# Altium schematic sheet nguyenly.schdoc
size B
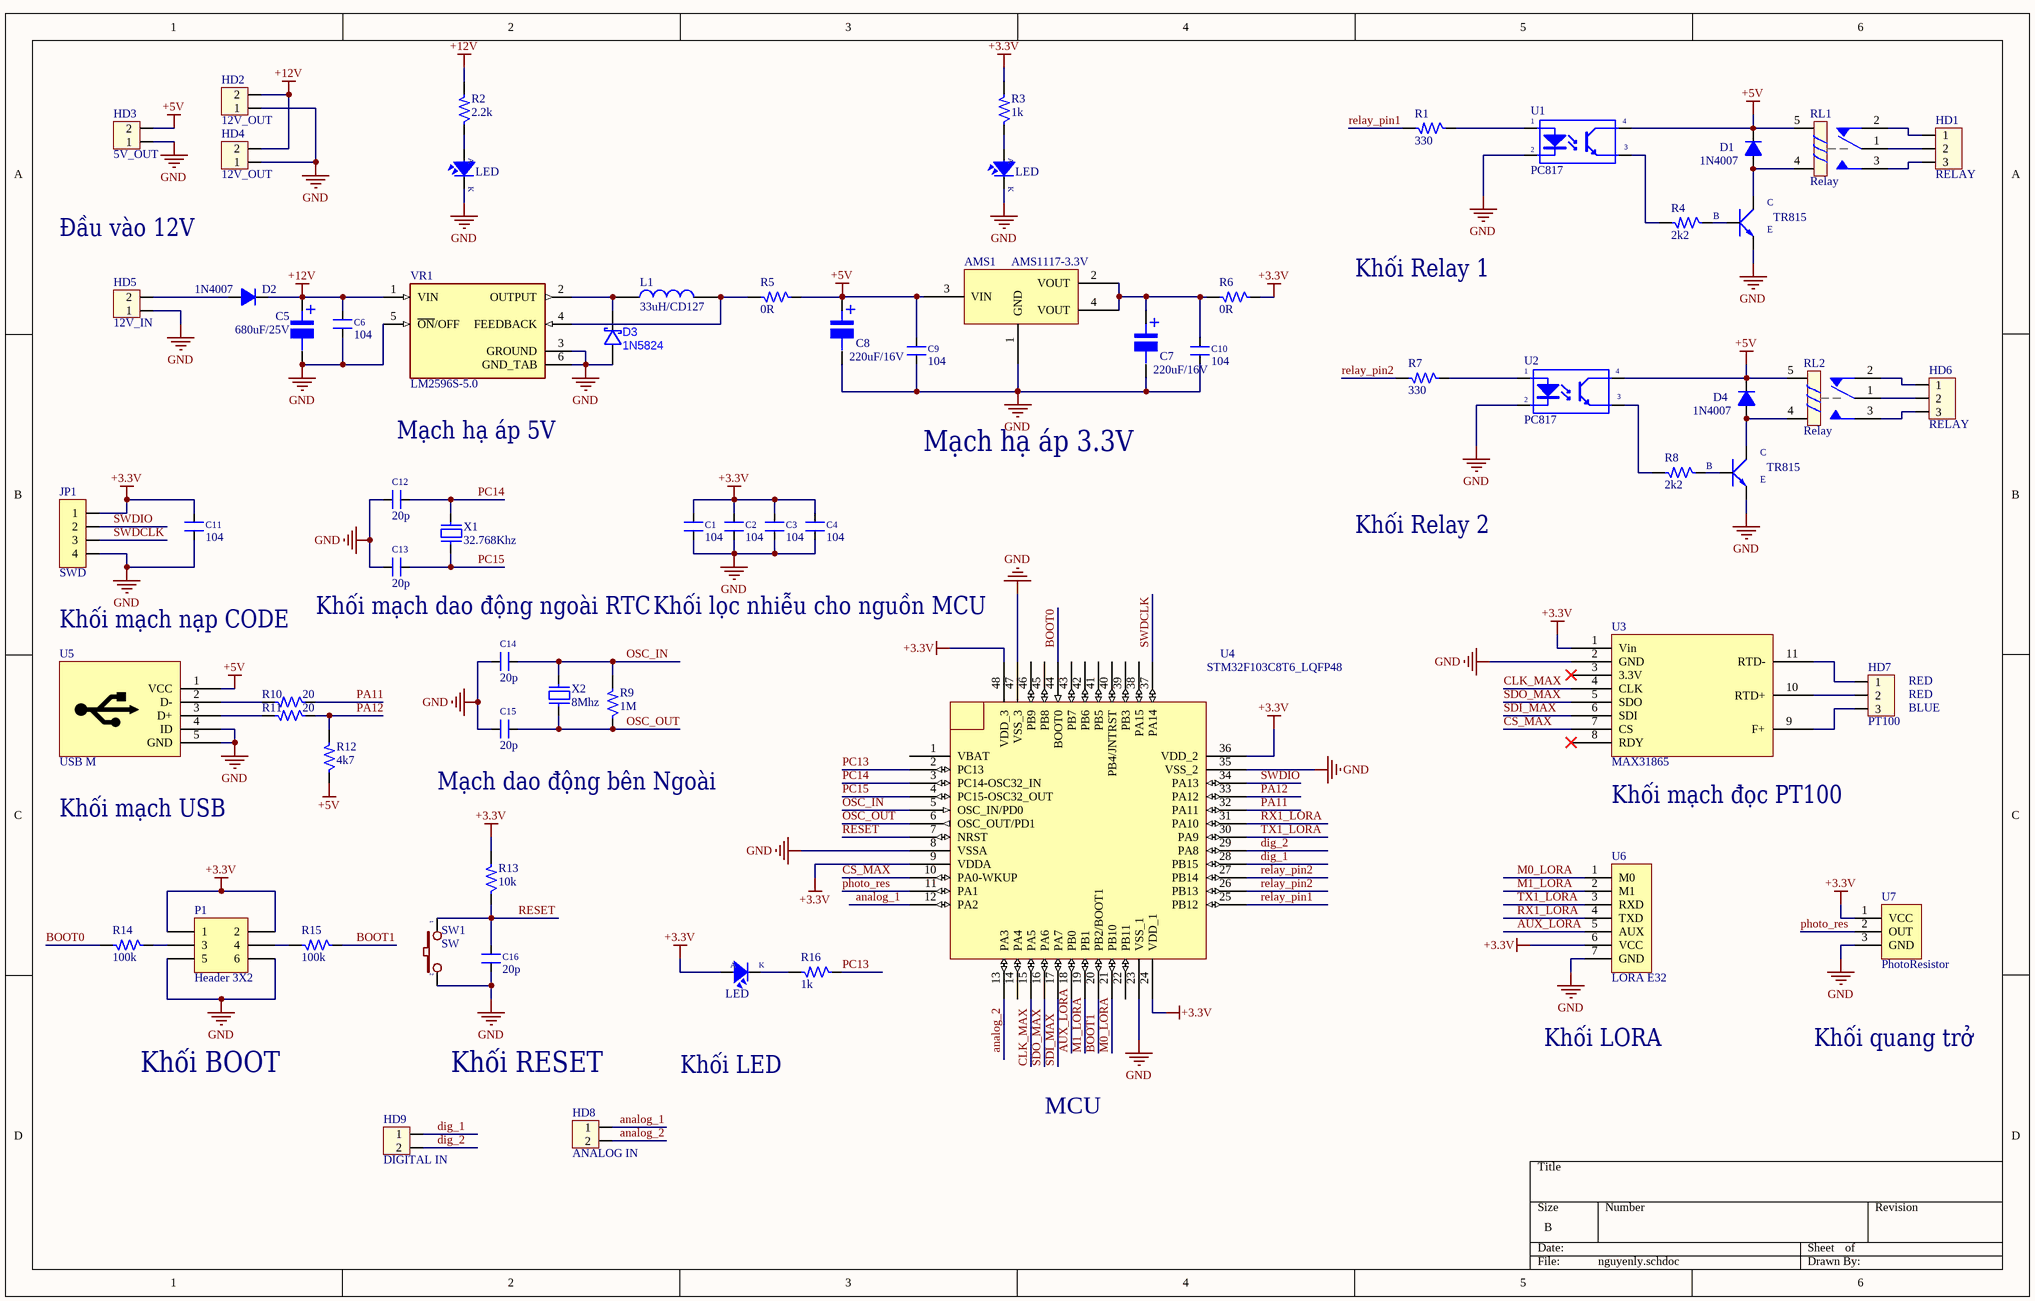
[diagram p0: nguyenly.schdoc]

## Parts
AMS1  AMS1117-3.3V  [SOT223]
C1  104  [SM-CAP-0805]
C2  104  [SM-CAP-0805]
C3  104  [SM-CAP-0805]
C4  104  [SM-CAP-0805]
C5  680uF/25V  [tu nhom 10 (G)]
C6  104  [SM-CAP-0805]
C7  220uF/16V  [tu nhom 6.3 (d)]
C8  220uF/16V  [tu nhom 6.3 (d)]
C9  104  [SM-CAP-0805]
C10  104  [SM-CAP-0805]
C11  104  [SM-CAP-0805]
C12  20p  [SM-CAP-0805]
C13  20p  [SM-CAP-0805]
C14  20p  [SM-CAP-0805]
C15  20p  [SM-CAP-0805]
C16  20p  [SM-CAP-0805]
D1  1N4007  [DO-214AC]
D2  1N4007  [DO-214AC]
D3  1N5824  [DO-214AA]
D4  1N4007  [DO-214AC]
HD1  RELAY  [HED3T]
HD2  12V_OUT  [HED2T]
HD3  5V_OUT  [HED2T]
HD4  12V_OUT  [HED2T]
HD5  12V_IN  [HED2T]
HD6  RELAY  [HED3T]
HD7  PT100  [HED3T]
HD8  ANALOG IN  [HED2T]
HD9  DIGITAL IN  [HED2T]
JP1  SWD  [JP 1x4 DT]
L1  33uH/CD127  [SRR1208]
LED1  LED  [LED-0805-Red]
LED2  LED  [LED-0805-Red]
LED3  LED  [LED-0805-Red]
P1  Header 3X2  [HDR2X3]
R1  330  [RES-SMD-0805]
R2  2.2k  [RES-SMD-0805]
R3  1k  [RES-SMD-0805]
R4  2k2  [RES-SMD-0805]
R5  0R  [RES-SMD-0805]
R6  0R  [RES-SMD-0805]
R7  330  [RES-SMD-0805]
R8  2k2  [RES-SMD-0805]
R9  1M  [RES-SMD-0805]
R10  20  [RES-SMD-0805]
R11  20  [RES-SMD-0805]
R12  4k7  [RES-SMD-0805]
R13  10k  [RES-SMD-0805]
R14  100k  [RES-SMD-0805]
R15  100k  [RES-SMD-0805]
R16  1k  [RES-SMD-0805]
RL1  Relay  [RL_SPDT_10A]
RL2  Relay  [RL_SPDT_10A]
STA.TR1  TR815  [QTO-92]
STA.TR2  TR815  [QTO-92]
SW1  SW  [SW4 CMD M]
U1  PC817  [SOP4]
U2  PC817  [SOP4]
U3  MAX31865  [MAX31865_module]
U4  STM32F103C8T6_LQFP48  [STM32_LQPF48]
U5  USB M  [USB_MICRO_B]
U6  LORA E32  [LORA E32]
U7  PhotoResistor  [PhotoResistor_module]
VR1  LM2596S-5.0  [TO170P1524X483-6N]
X1  32.768Khz  [CRYSTAL 32,768 kHz]
X2  8Mhz  [XT2]

## Nets
+3.3V: C1.2 C2.2 C3.2 C4.2 C11.2 JP1.1 LED3.1(A) P1.1 P1.2 R3.2 R6.1 R13.2 U3.1(Vin) U4.9(VDDA) U4.24(VDD_1) U4.36(VDD_2) U4.48(VDD_3) U6.6(VCC) U7.1(VCC)
+5V: AMS1.3(VIN) C8.1 C9.2 D1.K D4.K HD3.2 R5.1 R12.1 RL1.5 RL2.5 U1.4(C) U2.4(C) U5.1(VCC)
+12V: C5.1 C6.2 D2.K HD2.2 HD4.2 R2.2 VR1.1(VIN)
GND: AMS1.1(GND) C1.1 C2.1 C3.1 C4.1 C5.2 C6.1 C7.2 C8.2 C9.1 C10.1 C11.1 C12.2 C13.2 C14.2 C15.2 C16.2 D3.A HD2.1 HD3.1 HD4.1 HD5.1 JP1.4 LED1.2(K) LED2.2(K) P1.5 P1.6 STA.TR1.1(E) STA.TR2.1(E) SW1.2 U1.2(K) U2.2(K) U3.2(GND) U4.8(VSSA) U4.23(VSS_1) U4.35(VSS_2) U4.47(VSS_3) U5.4(ID) U5.5(GND) U6.7(GND) U7.3(GND) VR1.3(GROUND) VR1.5(~{ON}/OFF) VR1.6(GND_TAB)
analog_1: HD8.1 U4.12(PA2)
analog_2: HD8.2 U4.13(PA3)
AUX_LORA: U4.18(PB0) U6.5(AUX)
BOOT0: R14.2 U4.44(BOOT0)
BOOT1: R15.1 U4.20(PB2/BOOT1)
CLK_MAX: U3.4(CLK) U4.15(PA5)
CS_MAX: U3.7(CS) U4.10(PA0-WKUP)
dig_1: HD9.1 U4.28(PB15)
dig_2: HD9.2 U4.29(PA8)
M0_LORA: U4.21(PB10) U6.1(M0)
M1_LORA: U4.19(PB1) U6.2(M1)
OSC_IN: C14.1 R9.2 U4.5(OSC_IN/PD0) X2.2
OSC_OUT: C15.1 R9.1 U4.6(OSC_OUT/PD1) X2.1
PA11: R10.1 U4.32(PA11)
PA12: R11.1 R12.2 U4.33(PA12)
PC13: R16.1 U4.2(PC13)
PC14: C12.1 U4.3(PC14-OSC32_IN) X1.2
PC15: C13.1 U4.4(PC15-OSC32_OUT) X1.1
photo_res: U4.11(PA1) U7.2(OUT)
relay_pin1: R1.2 U4.25(PB12)
relay_pin2: R7.2 U4.26(PB13) U4.27(PB14)
RESET: C16.1 R13.1 SW1.1 U4.7(NRST)
RX1_LORA: U4.31(PA10) U6.4(TXD)
SDI_MAX: U3.6(SDI) U4.17(PA7)
SDO_MAX: U3.5(SDO) U4.16(PA6)
SWDCLK: JP1.3 U4.37(PA14)
SWDIO: JP1.2 U4.34(PA13)
TX1_LORA: U4.30(PA9) U6.3(RXD)
NetAMS1_2: AMS1.2(VOUT) AMS1.4(VOUT) C7.1 C10.2 R6.2
NetD1_A: D1.A RL1.4 STA.TR1.2(C)
NetD2_A: D2.A HD5.2
NetD3_K: D3.K L1.1 VR1.2(OUTPUT)
NetD4_A: D4.A RL2.4 STA.TR2.2(C)
NetHD1_1: HD1.1 RL1.2
NetHD1_2: HD1.2 RL1.1
NetHD1_3: HD1.3 RL1.3
NetHD6_1: HD6.1 RL2.2
NetHD6_2: HD6.2 RL2.1
NetHD6_3: HD6.3 RL2.3
NetHD7_1: HD7.1 U3.11(RTD-)
NetHD7_2: HD7.2 U3.10(RTD+)
NetHD7_3: HD7.3 U3.9(F+)
NetL1_2: L1.2 R5.2 VR1.4(FEEDBACK)
NetLED1_1: LED1.1(A) R2.1
NetLED2_1: LED2.1(A) R3.1
NetLED3_2: LED3.2(K) R16.2
NetP1_3: P1.3 R14.1
NetP1_4: P1.4 R15.2
NetR1_1: R1.1 U1.1(A)
NetR4_1: R4.1 STA.TR1.3(B)
NetR4_2: R4.2 U1.3(E)
NetR7_1: R7.1 U2.1(A)
NetR8_1: R8.1 STA.TR2.3(B)
NetR8_2: R8.2 U2.3(E)
NetR10_2: R10.2 U5.2(D-)
NetR11_2: R11.2 U5.3(D+)

Not connected (* = marked no-connect by the designer): U3 3(3.3V)* 8(RDY)*; U4 1(VBAT) 14(PA4) 22(PB11) 38(PA15) 39(PB3) 40(PB4/JNTRST) 41(PB5) 42(PB6) 43(PB7) 45(PB8) 46(PB9)

## Notes on the sheet
- Đầu vào 12V
- Khối Relay 1
- Mạch hạ áp 5V
- Mạch hạ áp 3.3V
- Khối Relay 2
- Khối mạch nạp CODE
- Khối mạch dao động ngoài RTC
- Khối lọc nhiễu cho nguồn MCU
- (near HD7) RED
- (near HD7) BLUE
- Khối mạch USB
- Mạch dao động bên Ngoài
- (near U3) Khối mạch đọc PT100
- Khối LORA
- Khối quang trở
- Khối BOOT
- Khối RESET
- Khối LED
- MCU
- (in symbol Tu Nhom 220uF 25V) +

## Library data of the parts
AMS1 = AMS1117 SMD: thegioiic. Dán (SOT-223); Value: AMS1117-3.3V SOT223; Don_Vi: Con; Ma_Hang: MH000596; Ghi_Chu: *; Kieu_Chan: *; Chung_Loai: Dán
C1-C4 C6 C9-C16 = CAP SMD: Value: 0,1uF/300V; Designed by: VanDungEvn
C5 C7 C8 = Tu Nhom 220uF 25V: Dán. Mua ở thegioiic; Chung_Loai: Dán; Don_Vi: Con; So_Chan: 2; Ten_Linh_Kien: Tụ Nhôm 220uF 25V; Ma_Hang: MH002221; Kieu_Chan: *
D1 D2 D4 = Diode  1N4007: Diode 1A; Value: 1N4007
D3 = DIODE_SCHOTTKY_MBRS130L: Diode Schottky SMD 30V 2A DO-214AA; Manufacturer 1: Fairchild Semiconductor; Material: Si; Ratings: 30Vr; 2A; SCDType: source; Package / Case: DO-214AA, SMB; Supplier 1: Digi-Key; Supplier Part Number 1: MBRS130LFSCT-ND; Manufacturer Part Number 1: MBRS130L
HD1 HD6 HD7 = Header 3: Header 3 (Green); Value: Header 3
HD2-HD5 HD8 HD9 = Header 2: Header 2 (Green); Value: Header 2
JP1 = JP 1x4 2.54 Duc Thang: Cắm; Ten_Linh_Kien: Jump Đơn Đực 2.54MM 1x40P Thẳng 11MM; Don_Vi: Con; Ma_Hang: MH000903; Ghi_Chu: *; Kieu_Chan: *; Chung_Loai: Cắm
L1 = Inductor Iron: Inductor
LED1-LED3 = LED: LED RED 0805; Value: LED 3 ly Single Colour
P1 = Header 3X2: Header, 3-Pin, Dual row; LatestRevisionDate: 17-Jul-2002; LatestRevisionNote: Re-released for DXP Platform.; Publisher: Altium Limited
R1-R16 = Res: Res SMD 0805
RL1 RL2 = Relay SRD: Relay SPDT 5 Pin; Value: Relay SPDT, 10A, 12V
STA.TR1 STA.TR2 = C1815: NPN 600mW, ECB; Value: C1815
SW1 = SW2: Switch button 2 pin; Value: SW chip 2 pin
U1 U2 = PC817: Single Opto; Value: PC817
U3 = MAX31865 Module
U4 = STM32F103xx_LQFP48: STM32 ARM-based 32-bit MCU with 64 Kbytes Flash, 48-pin LQFP, Industrial Temperature; Published: 30-May-2008; DatasheetVersion: rev6, Mar-2008; PackageVersion: Mar-2008; PackageReference: LQFP48; Publisher: Altium Limited; PackageDescription: 48-Pin Low-Profile Quad Flat Pack, 7 x 7 mm Body, 0.5 mm Pitch (LQFP48); ComponentLink1Description: Manufacturer Link; ComponentLink1URL: www.st.com/stm32; ComponentLink2Description: Datasheet; ComponentLink2URL: http://www.st.com/stonline/products/literature/ds/13587.pdf
VR1 = LM2596S-5.0: thegioiic. Dán (TO-263-5); MP: LM2596S-5.0/NOPB; MF: Texas Instruments; Price: None; Availability: In Stock; Package: TO-263-5 Texas Instruments; SnapEDA_Link: https://www.snapeda.com/parts/LM2596S-5.0/NOPB/Texas+Instruments/view-part/?ref=snap; Check_prices: https://www.snapeda.com/parts/LM2596S-5.0/NOPB/Texas+Instruments/view-part/?ref=eda; Value: *; Purchase-URL: https://pricing.snapeda.com/search/part/LM2596S-5.0/NOPB/?ref=eda
X1 = XT2: Crystal 32.768Khz 9pF and 12pF; Value: 4Mhz
X2 = XT2: Crystal For all Crystal 2pin.; Value: 4Mhz